# EAGLE design msgeq7-bargraph1 (EAGLE 6.5.0)
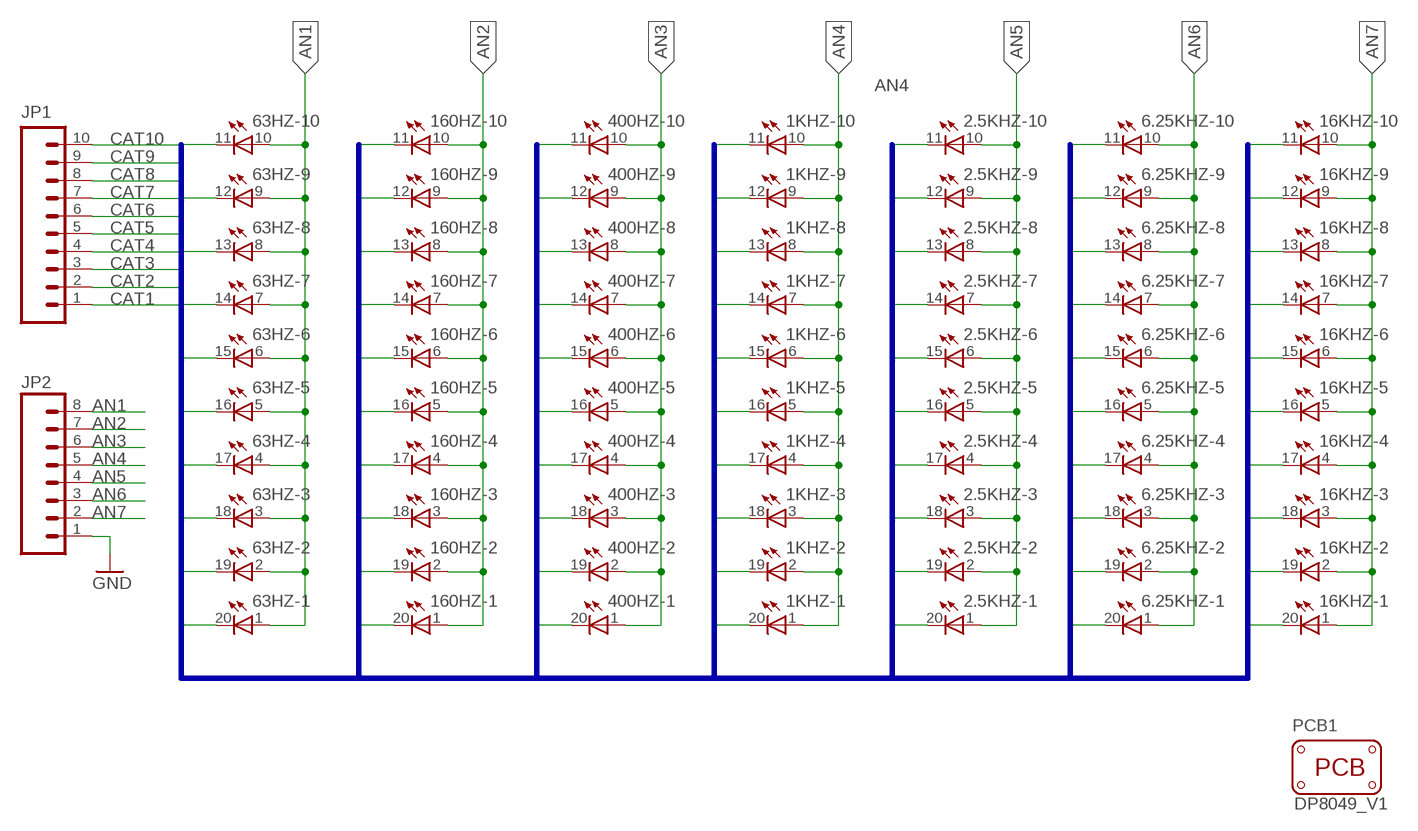
[diagram p0: schematic, sheet 1]

## Parts
1KHZ  LB10  [LB10]
2.5KHZ  LB10  [LB10]
6.25KHZ  LB10  [LB10]
16KHZ  LB10  [LB10]
63HZ  LB10  [LB10]
160HZ  LB10  [LB10]
400HZ  LB10  [LB10]
JP1  M10"  [1X10]
JP2  M081X08  [1X08]
PCB1  PCB_DP_RECTANGLE-80X49  [DP8049_V1]

## Nets
AN1: 63HZ.1(-1:A) 63HZ.2(-2:A) 63HZ.3(-3:A) 63HZ.4(-4:A) 63HZ.5(-5:A) 63HZ.6(-6:A) 63HZ.7(-7:A) 63HZ.8(-8:A) 63HZ.9(-9:A) 63HZ.10(-10:A) JP2.8
AN2: 160HZ.1(-1:A) 160HZ.2(-2:A) 160HZ.3(-3:A) 160HZ.4(-4:A) 160HZ.5(-5:A) 160HZ.6(-6:A) 160HZ.7(-7:A) 160HZ.8(-8:A) 160HZ.9(-9:A) 160HZ.10(-10:A) JP2.7
AN3: 400HZ.1(-1:A) 400HZ.2(-2:A) 400HZ.3(-3:A) 400HZ.4(-4:A) 400HZ.5(-5:A) 400HZ.6(-6:A) 400HZ.7(-7:A) 400HZ.8(-8:A) 400HZ.9(-9:A) 400HZ.10(-10:A) JP2.6
AN4: 1KHZ.1(-1:A) 1KHZ.2(-2:A) 1KHZ.3(-3:A) 1KHZ.4(-4:A) 1KHZ.5(-5:A) 1KHZ.6(-6:A) 1KHZ.7(-7:A) 1KHZ.8(-8:A) 1KHZ.9(-9:A) 1KHZ.10(-10:A) JP2.5
AN5: 2.5KHZ.1(-1:A) 2.5KHZ.2(-2:A) 2.5KHZ.3(-3:A) 2.5KHZ.4(-4:A) 2.5KHZ.5(-5:A) 2.5KHZ.6(-6:A) 2.5KHZ.7(-7:A) 2.5KHZ.8(-8:A) 2.5KHZ.9(-9:A) 2.5KHZ.10(-10:A) JP2.4
AN6: 6.25KHZ.1(-1:A) 6.25KHZ.2(-2:A) 6.25KHZ.3(-3:A) 6.25KHZ.4(-4:A) 6.25KHZ.5(-5:A) 6.25KHZ.6(-6:A) 6.25KHZ.7(-7:A) 6.25KHZ.8(-8:A) 6.25KHZ.9(-9:A) 6.25KHZ.10(-10:A) JP2.3
AN7: 16KHZ.1(-1:A) 16KHZ.2(-2:A) 16KHZ.3(-3:A) 16KHZ.4(-4:A) 16KHZ.5(-5:A) 16KHZ.6(-6:A) 16KHZ.7(-7:A) 16KHZ.8(-8:A) 16KHZ.9(-9:A) 16KHZ.10(-10:A) JP2.2
CAT1: 1KHZ.20(-1:C) 2.5KHZ.20(-1:C) 6.25KHZ.20(-1:C) 16KHZ.20(-1:C) 63HZ.20(-1:C) 160HZ.20(-1:C) 400HZ.20(-1:C) JP1.1
CAT2: 1KHZ.19(-2:C) 2.5KHZ.19(-2:C) 6.25KHZ.19(-2:C) 16KHZ.19(-2:C) 63HZ.19(-2:C) 160HZ.19(-2:C) 400HZ.19(-2:C) JP1.2
CAT3: 1KHZ.18(-3:C) 2.5KHZ.18(-3:C) 6.25KHZ.18(-3:C) 16KHZ.18(-3:C) 63HZ.18(-3:C) 160HZ.18(-3:C) 400HZ.18(-3:C) JP1.3
CAT4: 1KHZ.17(-4:C) 2.5KHZ.17(-4:C) 6.25KHZ.17(-4:C) 16KHZ.17(-4:C) 63HZ.17(-4:C) 160HZ.17(-4:C) 400HZ.17(-4:C) JP1.4
CAT5: 1KHZ.16(-5:C) 2.5KHZ.16(-5:C) 6.25KHZ.16(-5:C) 16KHZ.16(-5:C) 63HZ.16(-5:C) 160HZ.16(-5:C) 400HZ.16(-5:C) JP1.5
CAT6: 1KHZ.15(-6:C) 2.5KHZ.15(-6:C) 6.25KHZ.15(-6:C) 16KHZ.15(-6:C) 63HZ.15(-6:C) 160HZ.15(-6:C) 400HZ.15(-6:C) JP1.6
CAT7: 1KHZ.14(-7:C) 2.5KHZ.14(-7:C) 6.25KHZ.14(-7:C) 16KHZ.14(-7:C) 63HZ.14(-7:C) 160HZ.14(-7:C) 400HZ.14(-7:C) JP1.7
CAT8: 1KHZ.13(-8:C) 2.5KHZ.13(-8:C) 6.25KHZ.13(-8:C) 16KHZ.13(-8:C) 63HZ.13(-8:C) 160HZ.13(-8:C) 400HZ.13(-8:C) JP1.8
CAT9: 1KHZ.12(-9:C) 2.5KHZ.12(-9:C) 6.25KHZ.12(-9:C) 16KHZ.12(-9:C) 63HZ.12(-9:C) 160HZ.12(-9:C) 400HZ.12(-9:C) JP1.9
CAT10: 1KHZ.11(-10:C) 2.5KHZ.11(-10:C) 6.25KHZ.11(-10:C) 16KHZ.11(-10:C) 63HZ.11(-10:C) 160HZ.11(-10:C) 400HZ.11(-10:C) JP1.10
GND: JP2.1

## Buses
CAT[1..10]

## Library data of the parts
1KHZ 2.5KHZ 6.25KHZ 16KHZ 63HZ 160HZ 400HZ = ubiyubix:LB10: "10-LED bar graph, DIL, Kingbright"
JP1 = SparkFun-Connectors:M10: Header 10 Standard 10-pin 0.1" header. Use with straight break away headers (SKU : PRT-00116), right angle break away headers (PRT-00553), swiss pins (PRT-00743), machine pins (PRT-00117), and female headers (PRT-00115).
JP2 = SparkFun-Connectors:M08: Header 8 Standard 8-pin 0.1" header. Use with straight break away headers (SKU : PRT-00116), right angle break away headers (PRT-00553), swiss pins (PRT-00743), machine pins (PRT-00117), and female headers (PRT-00115).
PCB1 = dp_devices:PCB_DP_RECTANGLE: Dangerous Prototypes Standard Rectangular PCB sizes; PCB_SIZE: DP8049_V1

## Net classes
0 default: width 0.406 mm

## Board
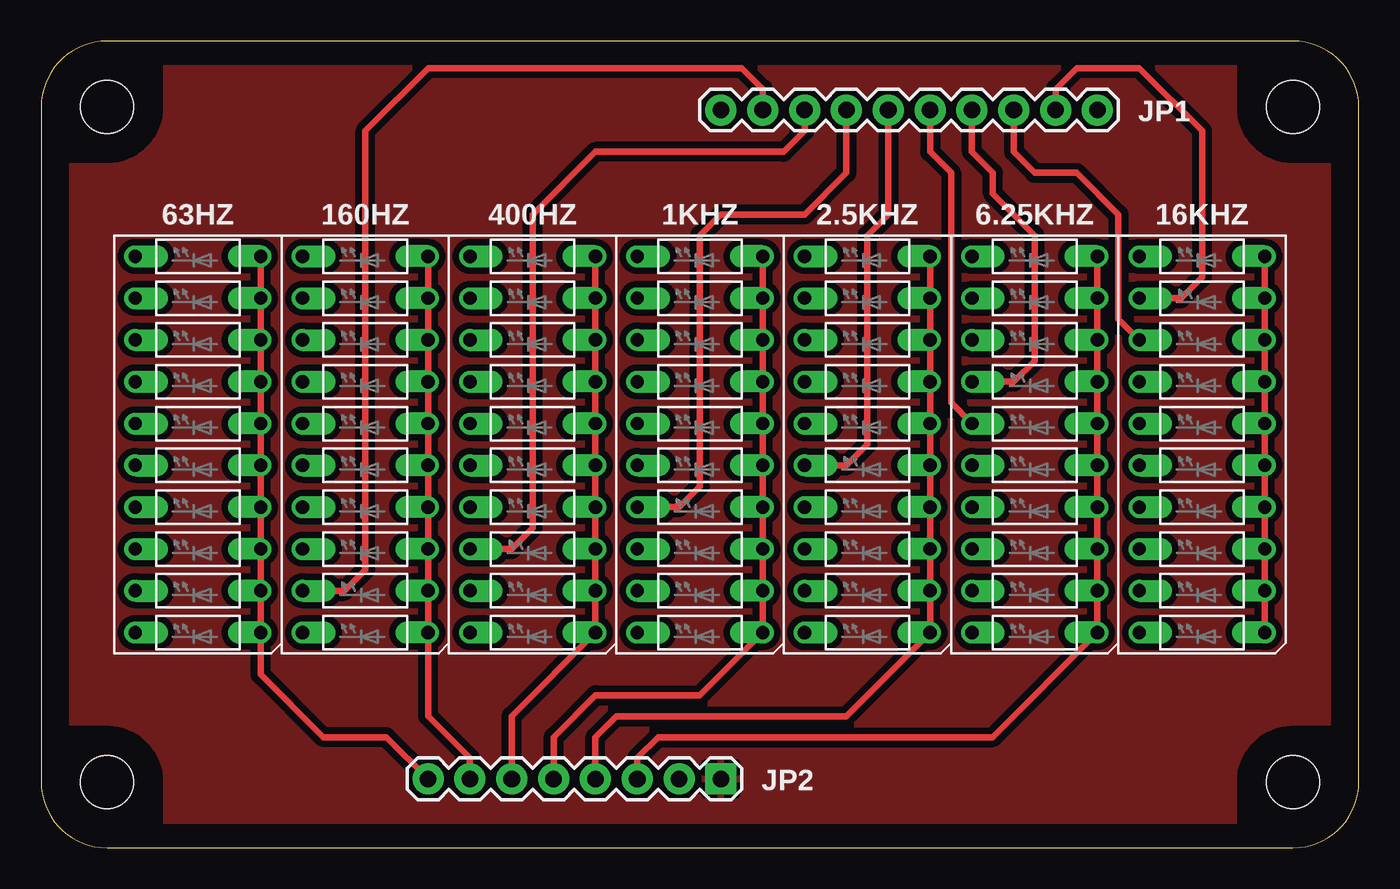
[diagram p1: board, top side]
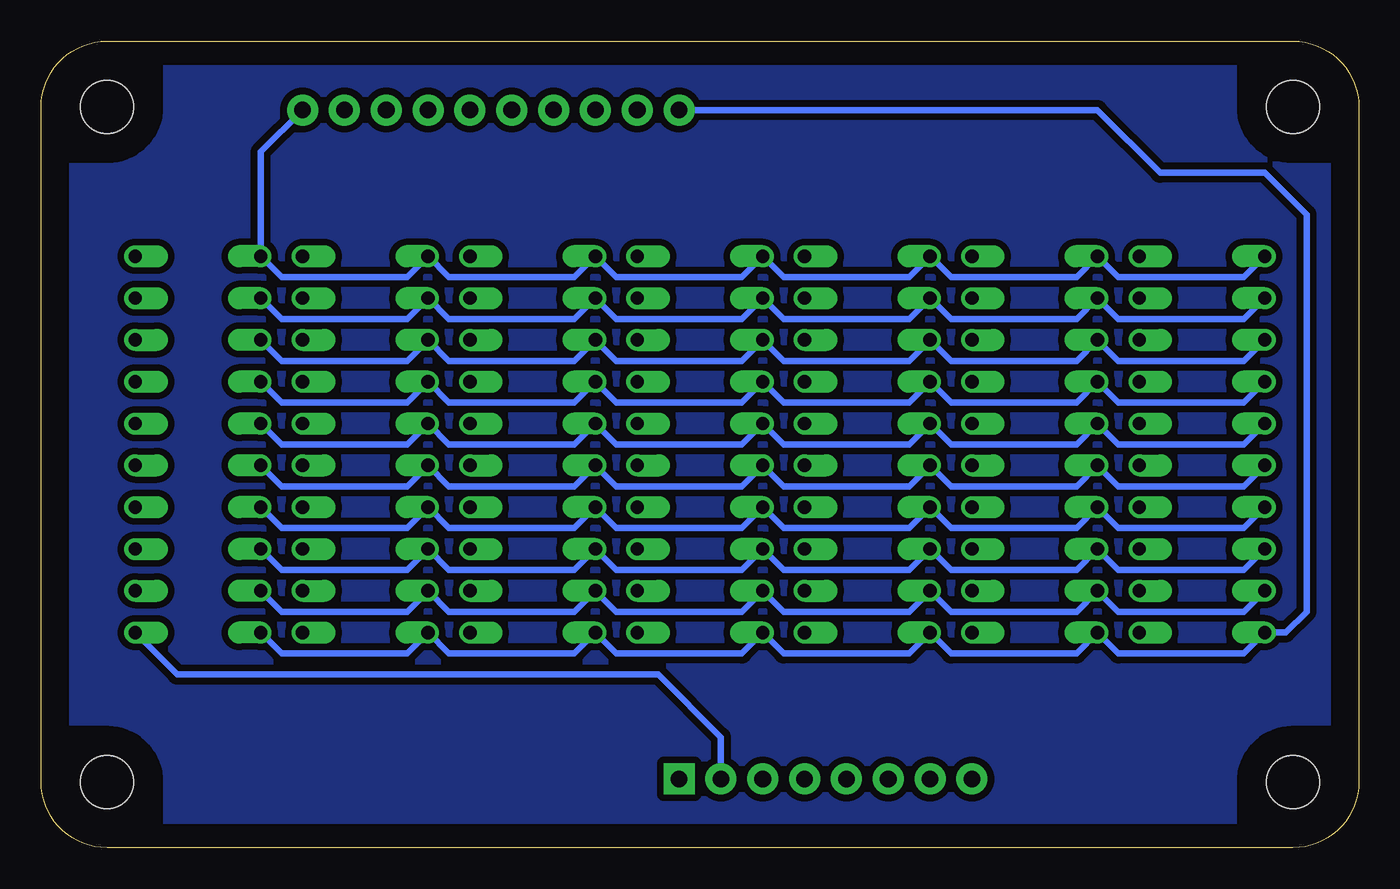
[diagram p2: board, bottom side, seen from below]

Size 80 x 49 mm. Coordinates in mm from the lower left corner, seen from the top.
Copper layers (1*16): Top 0.035mm / dielectric 1.5mm / Bottom 0.035mm
Design rules "SeeedStudio_2layer_DRU_no_angle_20140221": minimum track width 6mil, minimum drill 12mil, track to track 6mil, track to pad 6mil, pad to pad 6mil, via to via 6mil, smd to smd 0mil, copper to edge 10mil, drill to drill 10mil, minimum pad ring 10mil, minimum via ring 6mil, stop-mask expansion 2mil, vias tented up to drill 100mil, thermal gap 10mil

### Footprints (pad centres in the part's own frame; a part is rotated, then mirrored left to right if it is on the bottom)
LB10 = drill 0.813 offset: 1 -11.43,-3.81; 2 -8.89,-3.81; 3 -6.35,-3.81; 4 -3.81,-3.81; 5 -1.27,-3.81; 6 1.27,-3.81; 7 3.81,-3.81; 8 6.35,-3.81; 9 8.89,-3.81; 10 11.43,-3.81; 11 11.43,3.81; 12 8.89,3.81; 13 6.35,3.81; 14 3.81,3.81; 15 1.27,3.81; 16 -1.27,3.81; 17 -3.81,3.81; 18 -6.35,3.81; 19 -8.89,3.81; 20 -11.43,3.81
1X10 = drill 1.016 pad 1.88: 1 0,0; 2 2.54,0; 3 5.08,0; 4 7.62,0; 5 10.16,0; 6 12.7,0; 7 15.24,0; 8 17.78,0; 9 20.32,0; 10 22.86,0
1X08 = drill 1.016 pad 1.88 square: 1 0,0 | drill 1.016 pad 1.88: 2 2.54,0; 3 5.08,0; 4 7.62,0; 5 10.16,0; 6 12.7,0; 7 15.24,0; 8 17.78,0
DP8049_V1 = hole 3.2: -36,-20.5; 36,-20.5; 36,20.5; -36,20.5

### Placement (x,y rotation side)
1KHZ  40,24.5 90 top
2.5KHZ  50.16,24.5 90 top
6.25KHZ  60.32,24.5 90 top
16KHZ  70.48,24.5 90 top
63HZ  9.52,24.5 90 top
160HZ  19.68,24.5 90 top
400HZ  29.84,24.5 90 top
JP1  41.27,44.82 0 top
JP2  41.27,4.18 180 top
PCB1  40,24.5 0 top

### Tracks (layer width: path | path; a pad name or v marks a point on that pad's centre or on a via)
AN1
  Top 0.406: 63HZ.10 63HZ.9 63HZ.8 63HZ.7 63HZ.6 63HZ.5 63HZ.4 63HZ.3 63HZ.2 63HZ.1 13.33,10.53 17.14,6.72 20.95,6.72 JP2.8
AN2
  Top 0.406: 160HZ.10 160HZ.9 160HZ.8 160HZ.7 160HZ.6 160HZ.5 160HZ.4 160HZ.3 160HZ.2 160HZ.1 23.49,7.99 26.03,5.45 JP2.7
AN3
  Top 0.406: 400HZ.10 400HZ.9 400HZ.8 400HZ.7 400HZ.6 400HZ.5 400HZ.4 400HZ.3 400HZ.2 400HZ.1 28.57,7.99 JP2.6
AN4
  Top 0.406: 1KHZ.10 1KHZ.9 1KHZ.8 1KHZ.7 1KHZ.6 1KHZ.5 1KHZ.4 1KHZ.3 1KHZ.2 1KHZ.1 40,9.26 33.65,9.26 31.11,6.72 JP2.5
AN5
  Top 0.406: 2.5KHZ.10 2.5KHZ.9 2.5KHZ.8 2.5KHZ.7 2.5KHZ.6 2.5KHZ.5 2.5KHZ.4 2.5KHZ.3 2.5KHZ.2 2.5KHZ.1 48.89,7.99 34.92,7.99 33.65,6.72 JP2.4
AN6
  Top 0.406: 6.25KHZ.10 6.25KHZ.9 6.25KHZ.8 6.25KHZ.7 6.25KHZ.6 6.25KHZ.5 6.25KHZ.4 6.25KHZ.3 6.25KHZ.2 6.25KHZ.1 57.78,6.72 37.46,6.72 36.19,5.45 JP2.3
AN7
  Top 0.406: 16KHZ.1 16KHZ.2 16KHZ.3 16KHZ.4 16KHZ.5 16KHZ.6 16KHZ.7 16KHZ.8 16KHZ.9 16KHZ.10
  Bottom 0.406: 16KHZ.1 71.75,10.53 42.54,10.53 38.73,6.72 JP2.2
CAT1
  Bottom 0.406: 16KHZ.20 65.4,11.8 57.78,11.8 6.25KHZ.20 55.24,11.8 47.62,11.8 2.5KHZ.20 45.08,11.8 37.46,11.8 1KHZ.20 34.92,11.8 27.3,11.8 400HZ.20 24.76,11.8 17.14,11.8 160HZ.20 14.6,11.8 6.98,11.8 63HZ.20 4.44,13.07 3.17,14.34 3.17,38.47 5.71,41.01 12.06,41.01 15.87,44.82 JP1.1
CAT2
  Top 0.406: 160HZ.19 18.41,15.61 19.68,16.88 19.68,43.55 23.49,47.36 42.54,47.36 43.81,46.09 JP1.2
  Bottom 0.406: 63HZ.19 6.98,14.34 14.6,14.34 160HZ.19 17.14,14.34 24.76,14.34 400HZ.19 27.3,14.34 34.92,14.34 1KHZ.19 37.46,14.34 45.08,14.34 2.5KHZ.19 47.62,14.34 55.24,14.34 6.25KHZ.19 57.78,14.34 65.4,14.34 16KHZ.19
CAT3
  Top 0.406: 400HZ.18 28.57,18.15 29.84,19.42 29.84,38.47 33.65,42.28 45.08,42.28 46.35,43.55 JP1.3
  Bottom 0.406: 63HZ.18 6.98,16.88 14.6,16.88 160HZ.18 17.14,16.88 24.76,16.88 400HZ.18 27.3,16.88 34.92,16.88 1KHZ.18 37.46,16.88 45.08,16.88 2.5KHZ.18 47.62,16.88 55.24,16.88 6.25KHZ.18 57.78,16.88 65.4,16.88 16KHZ.18
CAT4
  Top 0.406: 1KHZ.17 38.73,20.69 40,21.96 40,37.2 41.27,38.47 46.35,38.47 48.89,41.01 JP1.4
  Bottom 0.406: 63HZ.17 6.98,19.42 14.6,19.42 160HZ.17 17.14,19.42 24.76,19.42 400HZ.17 27.3,19.42 34.92,19.42 1KHZ.17 37.46,19.42 45.08,19.42 2.5KHZ.17 47.62,19.42 55.24,19.42 6.25KHZ.17 57.78,19.42 65.4,19.42 16KHZ.17
CAT5
  Top 0.406: 2.5KHZ.16 48.89,23.23 50.16,24.5 50.16,37.2 51.43,38.47 JP1.5
  Bottom 0.406: 63HZ.16 6.98,21.96 14.6,21.96 160HZ.16 17.14,21.96 24.76,21.96 400HZ.16 27.3,21.96 34.92,21.96 1KHZ.16 37.46,21.96 45.08,21.96 2.5KHZ.16 47.62,21.96 55.24,21.96 6.25KHZ.16 57.78,21.96 65.4,21.96 16KHZ.16
CAT6
  Top 0.406: 6.25KHZ.15 55.24,27.04 55.24,41.01 53.97,42.28 JP1.6
  Bottom 0.406: 63HZ.15 6.98,24.5 14.6,24.5 160HZ.15 17.14,24.5 24.76,24.5 400HZ.15 27.3,24.5 34.92,24.5 1KHZ.15 37.46,24.5 45.08,24.5 2.5KHZ.15 47.62,24.5 55.24,24.5 6.25KHZ.15 57.78,24.5 65.4,24.5 16KHZ.15
CAT7
  Top 0.406: 6.25KHZ.14 59.05,28.31 60.32,29.58 60.32,37.2 57.78,39.74 57.78,41.01 56.51,42.28 JP1.7
  Bottom 0.406: 63HZ.14 6.98,27.04 14.6,27.04 160HZ.14 17.14,27.04 24.76,27.04 400HZ.14 27.3,27.04 34.92,27.04 1KHZ.14 37.46,27.04 45.08,27.04 2.5KHZ.14 47.62,27.04 55.24,27.04 6.25KHZ.14 57.78,27.04 65.4,27.04 16KHZ.14
CAT8
  Top 0.406: 16KHZ.13 65.4,32.12 65.4,38.47 62.86,41.01 60.32,41.01 59.05,42.28 JP1.8
  Bottom 0.406: 63HZ.13 6.98,29.58 14.6,29.58 160HZ.13 17.14,29.58 24.76,29.58 400HZ.13 27.3,29.58 34.92,29.58 1KHZ.13 37.46,29.58 45.08,29.58 2.5KHZ.13 47.62,29.58 55.24,29.58 6.25KHZ.13 57.78,29.58 65.4,29.58 16KHZ.13
CAT9
  Top 0.406: 16KHZ.12 69.21,33.39 70.48,34.66 70.48,43.55 66.67,47.36 62.86,47.36 61.59,46.09 JP1.9
  Bottom 0.406: 63HZ.12 6.98,32.12 14.6,32.12 160HZ.12 17.14,32.12 24.76,32.12 400HZ.12 27.3,32.12 34.92,32.12 1KHZ.12 37.46,32.12 45.08,32.12 2.5KHZ.12 47.62,32.12 55.24,32.12 6.25KHZ.12 57.78,32.12 65.4,32.12 16KHZ.12
CAT10
  Bottom 0.406: 63HZ.11 6.98,34.66 14.6,34.66 160HZ.11 17.14,34.66 24.76,34.66 400HZ.11 27.3,34.66 34.92,34.66 1KHZ.11 37.46,34.66 45.08,34.66 2.5KHZ.11 47.62,34.66 55.24,34.66 6.25KHZ.11 57.78,34.66 65.4,34.66 16KHZ.11 66.67,42.28 JP1.10
GND
  pour Top (isolate 0.406): 1.9,47.36 78.1,47.36 78.1,1.64 1.9,1.64
N$1
  pour Bottom (isolate 0.406): 1.9,47.36 78.1,47.36 78.1,1.64 1.9,1.64